# Altium schematic sheet NanoFury16.SchDoc
size A
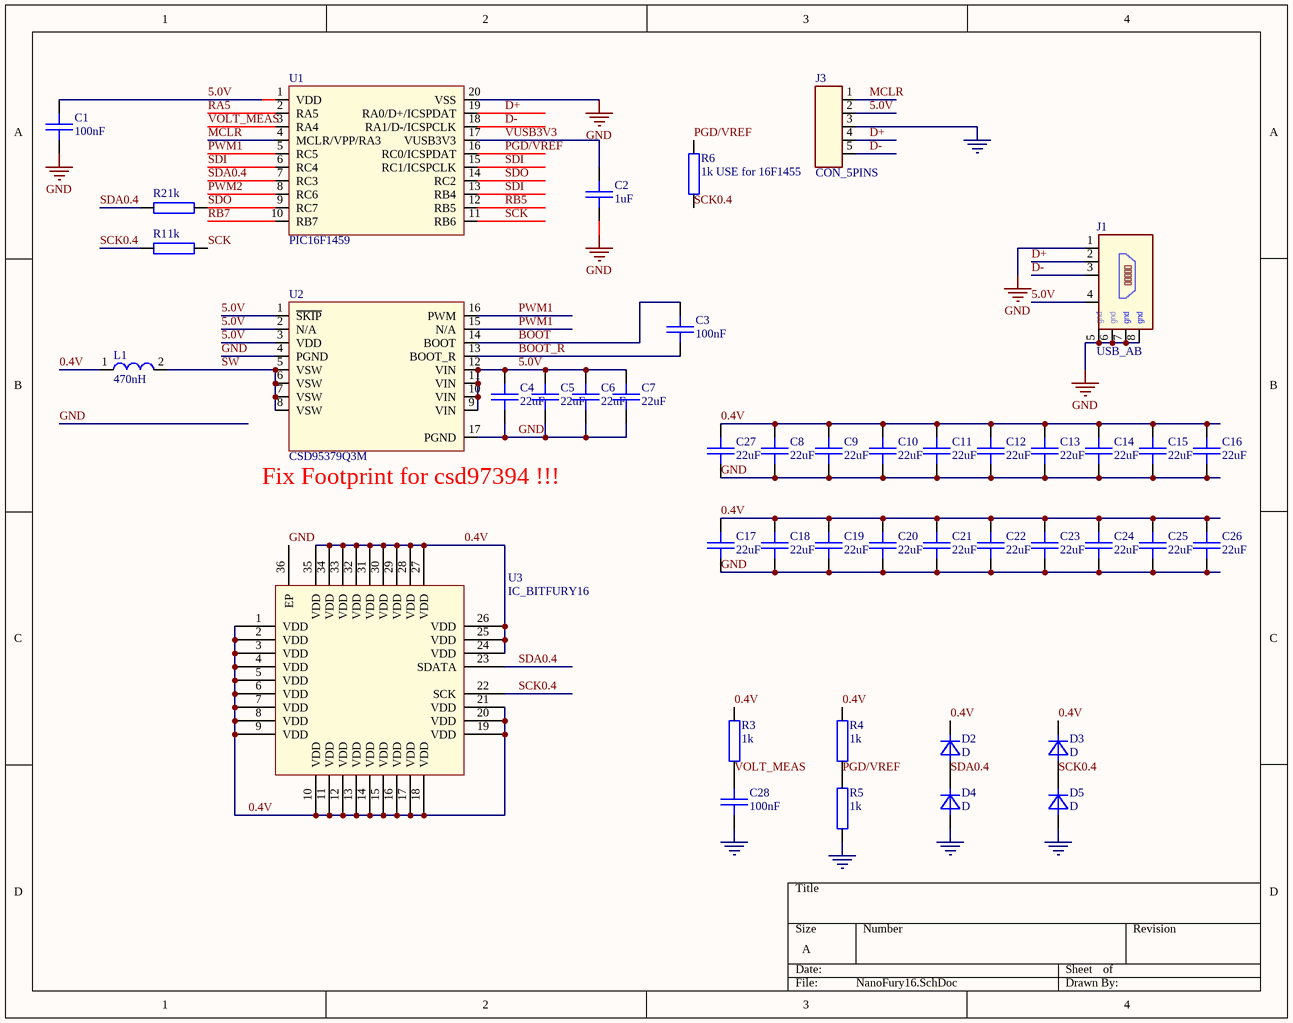
[diagram p0: NanoFury16.SchDoc]

## Parts
C1  100nF  [SMD_0603_CAPC1608X95N]
C2  1uF  [SMD_0603_CAPC1608X95N]
C3  100nF  [SMD_0603_CAPC1608X95N]
C4  22uF  [SMD_0805_CAPC2012X95N]
C5  22uF  [SMD_0805_CAPC2012X95N]
C6  22uF  [SMD_0805_CAPC2012X95N]
C7  22uF  [SMD_0805_CAPC2012X95N]
C8  22uF  [SMD_0805_CAPC2012X95N]
C9  22uF  [SMD_0805_CAPC2012X95N]
C10  22uF  [SMD_0805_CAPC2012X95N]
C11  22uF  [SMD_0805_CAPC2012X95N]
C12  22uF  [SMD_0805_CAPC2012X95N]
C13  22uF  [SMD_0805_CAPC2012X95N]
C14  22uF  [SMD_0805_CAPC2012X95N]
C15  22uF  [SMD_0805_CAPC2012X95N]
C16  22uF  [SMD_0805_CAPC2012X95N]
C17  22uF  [SMD_0805_CAPC2012X95N]
C18  22uF  [SMD_0805_CAPC2012X95N]
C19  22uF  [SMD_0805_CAPC2012X95N]
C20  22uF  [SMD_0805_CAPC2012X95N]
C21  22uF  [SMD_0805_CAPC2012X95N]
C22  22uF  [SMD_0805_CAPC2012X95N]
C23  22uF  [SMD_0805_CAPC2012X95N]
C24  22uF  [SMD_0805_CAPC2012X95N]
C25  22uF  [SMD_0805_CAPC2012X95N]
C26  22uF  [SMD_0805_CAPC2012X95N]
C27  22uF  [SMD_0805_CAPC2012X95N]
C28  100nF  [SMD_0603_CAPC1608X95N]
D2  D  [SMD_SOD523_SOD1608X65N]
D3  D  [SMD_SOD523_SOD1608X65N]
D4  D  [SMD_SOD523_SOD1608X65N]
D5  D  [SMD_SOD523_SOD1608X65N]
J1  USB_AB  [PTH_CON_USB_FCI-87520-0010B-LF - MALE SMD PTH]
J3  CON_5PINS  [SIP5 - PGM]
L1  470nH  [SMD_INDM720X665X300]
R1  1k  [SMD_0603_RESC1608X55N]
R2  1k  [SMD_0603_RESC1608X55N]
R3  1k  [SMD_0603_RESC1608X55N]
R4  1k  [SMD_0603_RESC1608X55N]
R5  1k  [SMD_0603_RESC1608X55N]
R6  1k USE for 16F1455  [SMD_0603_RESC1608X55N]
U1  PIC16F1459  [SMD_SOP65P640X110-20N]
U2  CSD95379Q3M  [SMD_SON50P340X340X80-21N - VSON10]
U3  IC_BITFURY16  [SMD_QFN65P600X600X100-36AN]

## Nets
GND: C1.2 C2.2 C4.2 C5.2 C6.2 C7.2 C8.2 C9.2 C10.2 C11.2 C12.2 C13.2 C14.2 C15.2 C16.2 C17.2 C18.2 C19.2 C20.2 C21.2 C22.2 C23.2 C24.2 C25.2 C26.2 C27.2 C28.2 D4.2(A) D5.2(A) J1.1 J1.5 J1.6 J1.7 J1.8 J3.3 R5.2 U1.20(VSS) U2.4(PGND) U2.17(PGND) U3.36(EP)
0.4V: C8.1 C9.1 C10.1 C11.1 C12.1 C13.1 C14.1 C15.1 C16.1 C17.1 C18.1 C19.1 C20.1 C21.1 C22.1 C23.1 C24.1 C25.1 C26.1 C27.1 D2.1(C) D3.1(C) L1.1 R3.1 R4.1 U3.1(VDD) U3.2(VDD) U3.3(VDD) U3.4(VDD) U3.5(VDD) U3.6(VDD) U3.7(VDD) U3.8(VDD) U3.9(VDD) U3.10(VDD) U3.11(VDD) U3.12(VDD) U3.13(VDD) U3.14(VDD) U3.15(VDD) U3.16(VDD) U3.17(VDD) U3.18(VDD) U3.19(VDD) U3.20(VDD) U3.21(VDD) U3.24(VDD) U3.25(VDD) U3.26(VDD) U3.27(VDD) U3.28(VDD) U3.29(VDD) U3.30(VDD) U3.31(VDD) U3.32(VDD) U3.33(VDD) U3.34(VDD) U3.35(VDD)
5.0V: C1.1 C4.1 C5.1 C6.1 C7.1 J1.4 J3.2 U1.1(VDD) U2.1(~{SKIP}) U2.2(N/A) U2.3(VDD) U2.9(VIN) U2.10(VIN) U2.11(VIN) U2.12(VIN)
BOOT: C3.1 U2.14(BOOT)
BOOT_R: C3.2 U2.13(BOOT_R)
D+: J1.2 J3.4 U1.19(RA0/D+/ICSPDAT)
D-: J1.3 J3.5 U1.18(RA1/D-/ICSPCLK)
MCLR: J3.1 U1.4(MCLR/VPP/RA3)
PGD/VREF: R4.2 R5.1 R6.1 U1.16(RC0/ICSPDAT)
PWM1: U1.5(RC5) U2.15(N/A) U2.16(PWM)
PWM2: U1.8(RC6)
RA5: U1.2(RA5)
RB5: U1.12(RB5)
RB7: U1.10(RB7)
SCK: R1.2 U1.11(RB6)
SCK0.4: D3.2(A) D5.1(C) R1.1 R6.2 U3.22(SCK)
SDA0.4: D2.2(A) D4.1(C) R2.2 U1.7(RC3) U3.23(SDATA)
SDI: U1.6(RC4) U1.13(RB4) U1.15(RC1/ICSPCLK)
SDO: R2.1 U1.9(RC7) U1.14(RC2)
SW: L1.2 U2.5(VSW) U2.6(VSW) U2.7(VSW) U2.8(VSW)
VOLT_MEAS: C28.1 R3.2 U1.3(RA4)
VUSB3V3: C2.1 U1.17(VUSB3V3)

## Notes on the sheet
- (near U2) Fix Footprint for csd97394 !!!
- (in symbol CON_USB_AB) gnd

## Library data of the parts
C1-C28 = C: NOTE: <NOTE>
D2-D5 = D: NOTE: <NOTE>
J1 = CON_USB_AB: NOTE: <NOTE>
J3 = CON_5PINS: NOTE: <NOTE>
L1 = L
R1-R6 = R: NOTE: <NOTE>; R_BDS: R
U1 = IC_PIC16F1459
U2 = IC_CSD95379Q3M: Texas Instrumendts Buck Boost DC-DC
U3 = IC_BITFURY16: BitFury 2016 16 nm